# Altium schematic sheet USB PD.SchDoc: USB PD
size 431 x 279 mm; DrawnBy: DD; DocumentNumber: GHL-1-21002; Revision: A; SheetNumber: 5; SheetTotal: 7; ProjectID: 263-03
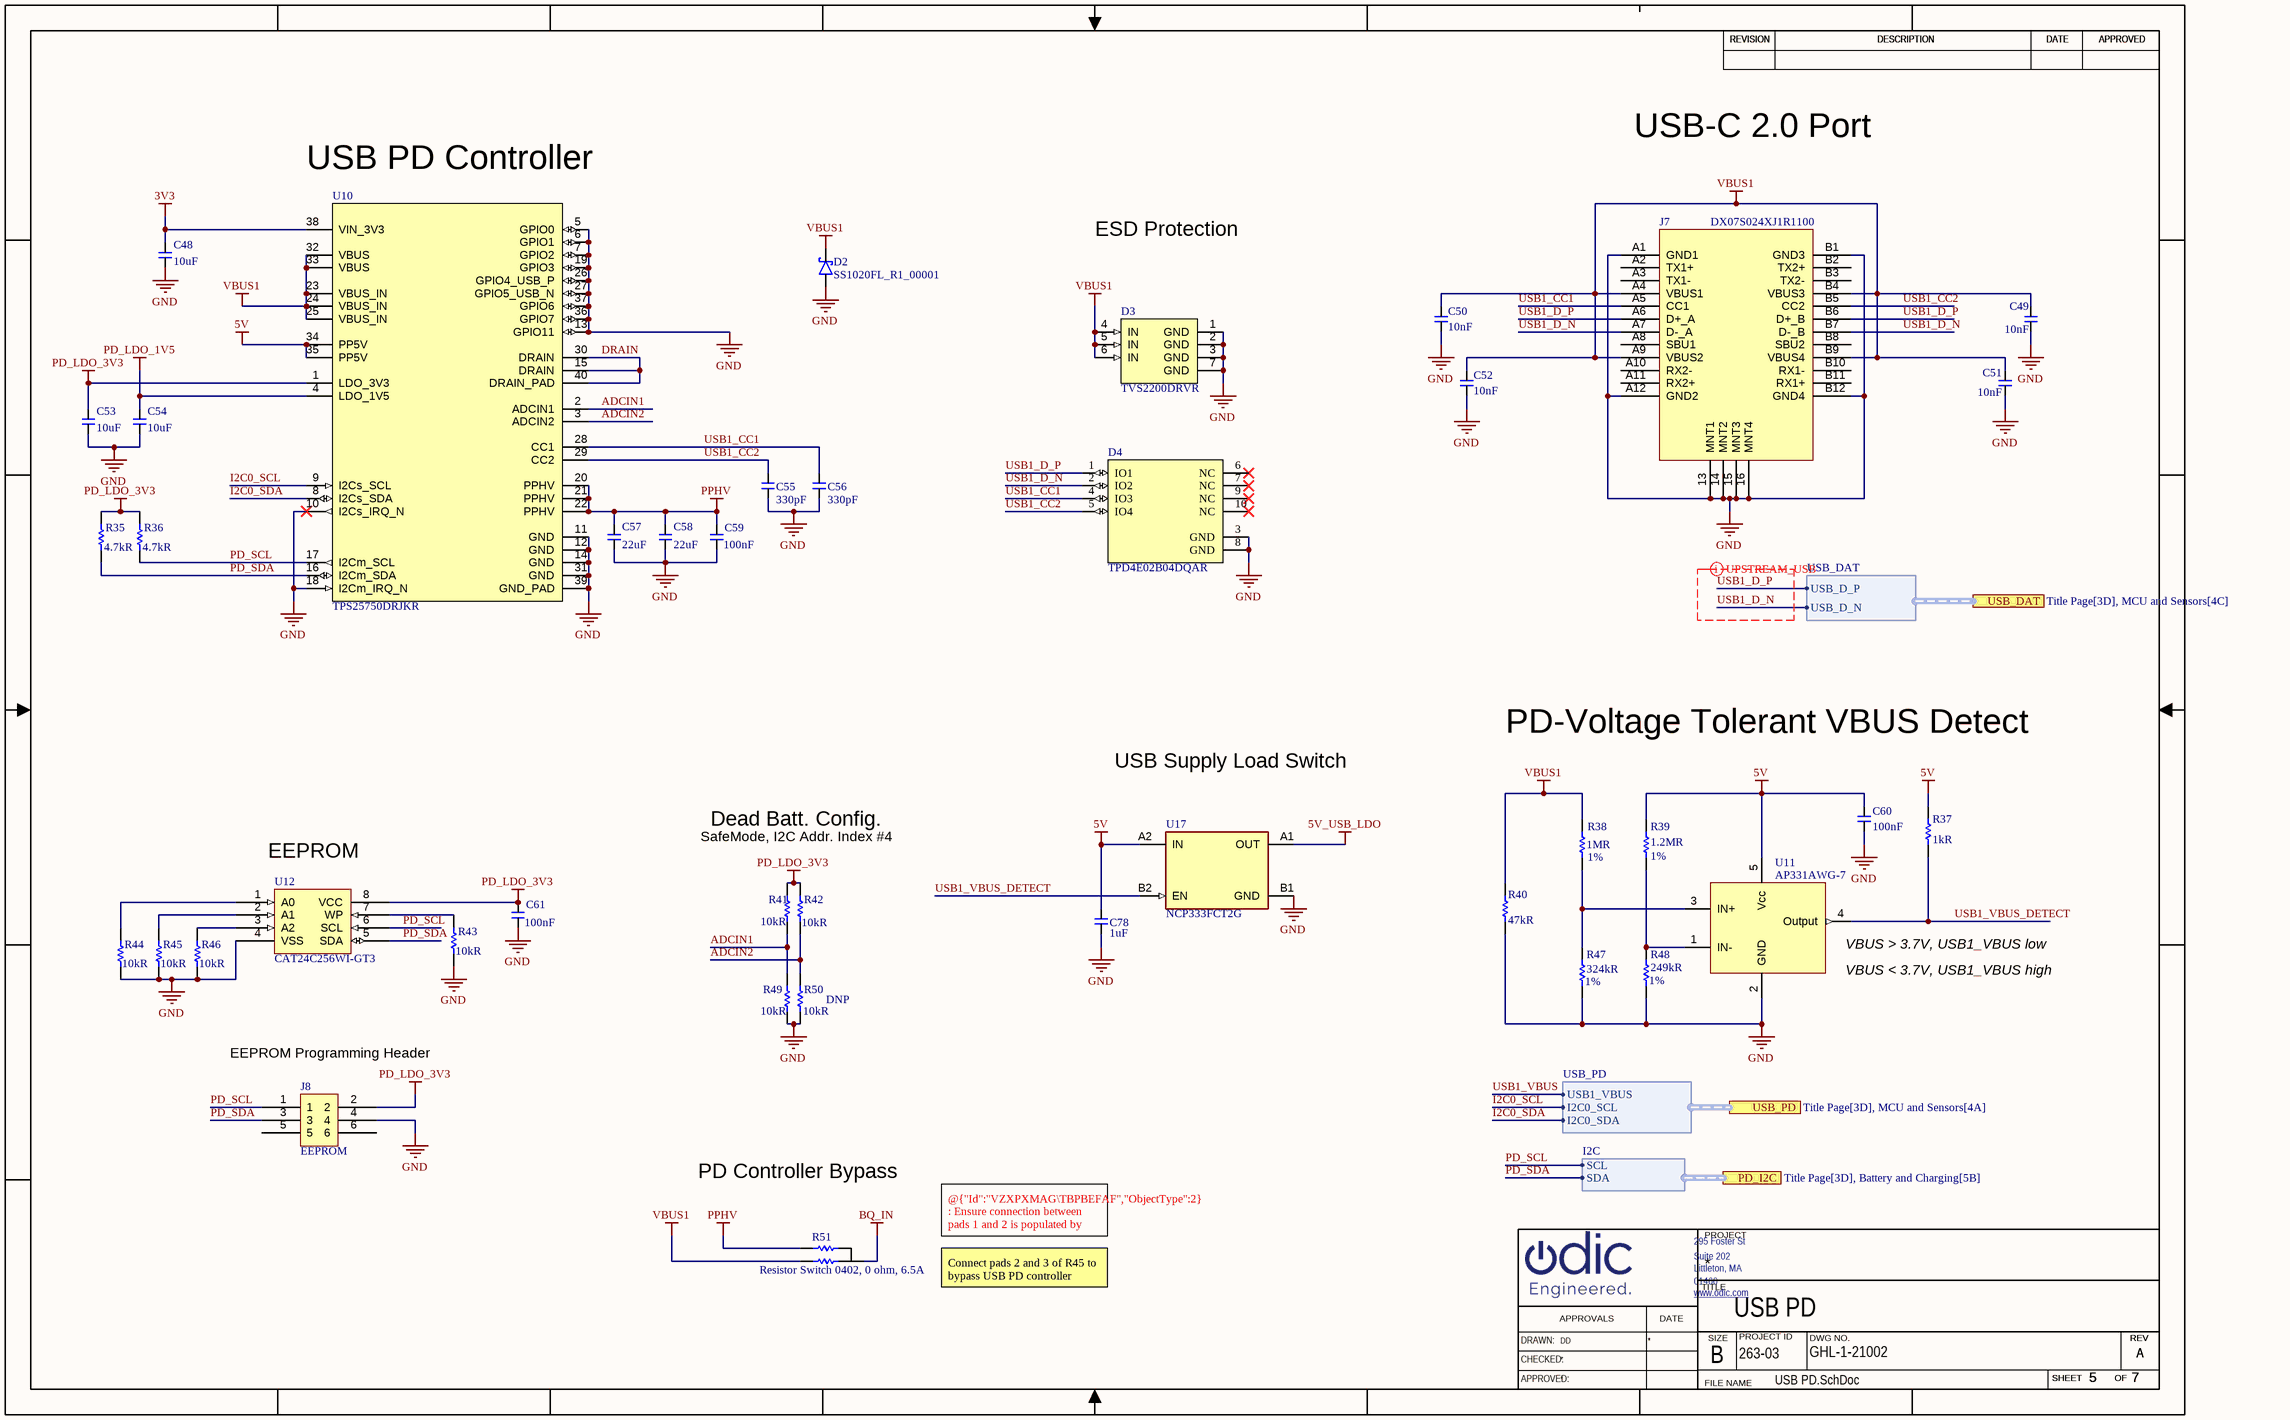
[diagram p0: USB PD.SchDoc]

## Parts
C48  Capacitance: 10uF  [C0402]  (hidden comment: C0402_10u_10V_20pct)
C49  value 10nF  [C0402]  (hidden comment: C0402_10n_35V_10pct)
C50  value 10nF  [C0402]  (hidden comment: C0402_10n_35V_10pct)
C51  value 10nF  [C0402]  (hidden comment: C0402_10n_35V_10pct)
C52  value 10nF  [C0402]  (hidden comment: C0402_10n_35V_10pct)
C53  Capacitance: 10uF  [C0402]  (hidden comment: C0402_10u_10V_20pct)
C54  Capacitance: 10uF  [C0402]  (hidden comment: C0402_10u_10V_20pct)
C55  value 330pF  [C0402]  (hidden comment: C0402_330p_50V_10pct)
C56  value 330pF  [C0402]  (hidden comment: C0402_330p_50V_10pct)
C57  Capacitance: 22uF  [c0805]  (hidden comment: C0805_22u_25V_20pct)
C58  Capacitance: 22uF  [c0805]  (hidden comment: C0805_22u_25V_20pct)
C59  Capacitance: 100nF  [C0402]  (hidden comment: C0402_0u1_25V_10pct)
C60  Capacitance: 100nF  [C0402]  (hidden comment: C0402_100n_16V_10pct)
C61  Capacitance: 100nF  [C0402]  (hidden comment: C0402_0u1_25V_10pct)
C78  Capacitance: 1uF  [C0402]  (hidden comment: C0402_1u_6V3_10pct)
D2  SS1020FL_R1_00001  [sod-123fl_AK]
D3  TVS2200DRVR  [dfn7_2x2_p65mm]
D4  TPD4E02B04DQAR  [dfn10_1p1x2p6_p5mm]
J7  DX07S024XJ1R1100  [USB_JAE_DX07S024XJ1R1100]
J8  EEPROM  [tc2030-mcp-nl]
R35  Resistance: 4.7kR  [R0402]  (hidden comment: R0402_4k7_1pct)
R36  Resistance: 4.7kR  [R0402]  (hidden comment: R0402_4k7_1pct)
R37  Resistance: 1kR  [R0402]  (hidden comment: R0402_1k0_1pct)
R38  value 1MR  Tolerance: 1%  [R0402]  (hidden comment: R0402_1M_1pct)
R39  Resistance: 1.2MR  Tolerance: 1%  [R0402]  (hidden comment: R0402_1M2_1pct)
R40  Resistance: 47kR  [R0402]  (hidden comment: R0402_47k_1pct)
R41  Resistance: 10kR  [R0402]  (hidden comment: R0402_10k_1pct)
R42  Resistance: 10kR  [R0402]  (hidden comment: R0402_10k_1pct)
R43  Resistance: 10kR  [R0402]  (hidden comment: R0402_10k_1pct)
R44  Resistance: 10kR  [R0402]  (hidden comment: R0402_10k_1pct)
R45  Resistance: 10kR  [R0402]  (hidden comment: R0402_10k_1pct)
R46  Resistance: 10kR  [R0402]  (hidden comment: R0402_10k_1pct)
R47  value 324kR  Tolerance: 1%  [R0402]  (hidden comment: R0402_324k_1pct)
R48  Tolerance: 1%  Resistance: 249kR  [R0402]  (hidden comment: R0402_249k_1pct)
R49  Resistance: 10kR  [R0402]  (hidden comment: R0402_10k_1pct)
R50  Resistance: 10kR  Install: DNP  [R0402]  (hidden comment: R0402_10k_1pct)
R51  Resistor Switch 0402, 0 ohm, 6.5A  [r0402x2]
U10  TPS25750DRJKR  [qfn40_6x4_p4mm-RJK0038B]
U11  AP331AWG-7  [SOT25]
U12  CAT24C256WI-GT3  [SO8]
U17  NCP333FCT2G  [bga4_p743xp743_p4mm]

## Ports
PD_I2C (harness I2C, see Title Page[3D], Battery and Charging[5B]), USB_DAT (harness USB_DAT, see Title Page[3D], MCU and Sensors[4C]), USB_PD (harness USB_PD, see Title Page[3D], MCU and Sensors[4A])

## Harnesses
USB_PD: USB1_VBUS, I2C0_SCL, I2C0_SDA
USB_DAT: USB_D_P, USB_D_N
I2C: SCL, SDA

## Nets
3V3: C48.2 U10.38(VIN_3V3)
5V: C60.2 C78.2 R37.2 R39.2 U10.34(PP5V) U10.35(PP5V) U11.5(Vcc) U17.A2(IN)
5V_USB_LDO: U17.A1(OUT)
BQ_IN: R51.2
GND: C48.1 C49.1 C50.1 C51.1 C52.1 C53.1 C54.1 C55.1 C56.1 C57.1 C58.1 C59.1 C60.1 C61.1 C78.1 D2.A D3.1(GND) D3.2(GND) D3.3(GND) D3.7(GND) D4.3(GND) D4.8(GND) J7.13(MNT1) J7.14(MNT2) J7.15(MNT3) J7.16(MNT4) J7.A1(GND1) J7.A12(GND2) J7.B1(GND3) J7.B12(GND4) J8.4 R40.1 R43.1 R44.1 R45.1 R46.1 R47.1 R48.1 R49.1 R50.1 U10.5(GPIO0) U10.6(GPIO1) U10.7(GPIO2) U10.10(I2Cs_IRQ_N) U10.11(GND) U10.12(GND) U10.13(GPIO11) U10.14(GND) U10.18(I2Cm_IRQ_N) U10.19(GPIO3) U10.26(GPIO4_USB_P) U10.27(GPIO5_USB_N) U10.31(GND) U10.36(GPIO7) U10.37(GPIO6) U10.39(GND_PAD) U11.2(GND) U12.4(VSS) U17.B1(GND)
PD_LDO_1V5: C54.2 U10.4(LDO_1V5)
PD_LDO_3V3: C53.2 C61.2 J8.2 R35.2 R36.2 R41.2 R42.2 U10.1(LDO_3V3) U12.8(VCC)
PPHV: C57.2 C58.2 C59.2 R51.1 U10.20(PPHV) U10.21(PPHV) U10.22(PPHV)
VBUS1: C49.2 C50.2 C51.2 C52.2 D2.K D3.4(IN) D3.5(IN) D3.6(IN) J7.A4(VBUS1) J7.A9(VBUS2) J7.B4(VBUS3) J7.B9(VBUS4) R38.2 R40.2 R51.3 U10.23(VBUS_IN) U10.24(VBUS_IN) U10.25(VBUS_IN) U10.32(VBUS) U10.33(VBUS)
ADCIN1: R41.1 R49.2 U10.2(ADCIN1)
ADCIN2: R42.1 R50.2 U10.3(ADCIN2)
DRAIN: U10.15(DRAIN) U10.30(DRAIN) U10.40(DRAIN_PAD)
I2C0_SCL: U10.9(I2Cs_SCL) ; port USB_PD.I2C0_SCL
I2C0_SDA: U10.8(I2Cs_SDA) ; port USB_PD.I2C0_SDA
PD_SCL: J8.1 R36.1 U10.17(I2Cm_SCL) U12.6(SCL) ; port PD_I2C.SCL
PD_SDA: J8.3 R35.1 U10.16(I2Cm_SDA) U12.5(SDA) ; port PD_I2C.SDA
USB1_CC1: C56.2 D4.4(IO3) J7.A5(CC1) U10.28(CC1)
USB1_CC2: C55.2 D4.5(IO4) J7.B5(CC2) U10.29(CC2)
USB1_D_N: D4.2(IO2) J7.A7(D-_A) J7.B7(D-_B) ; port USB_DAT.USB_D_N
USB1_D_P: D4.1(IO1) J7.A6(D+_A) J7.B6(D+_B) ; port USB_DAT.USB_D_P
USB1_VBUS: port USB_PD.USB1_VBUS
USB1_VBUS_DETECT: R37.1 U11.4(Output) U17.B2(EN)
NetR38_1: R38.1 R47.2 U11.3(IN+)
NetR39_1: R39.1 R48.2 U11.1(IN-)
NetR43_2: R43.2 U12.7(WP)
NetR44_2: R44.2 U12.1(A0)
NetR45_2: R45.2 U12.2(A1)
NetR46_2: R46.2 U12.3(A2)

Not connected (* = marked no-connect by the designer): D4 6(NC)* 7(NC)* 9(NC)* 10(NC)*; J7 A2(TX1+) A3(TX1-) A8(SBU1) A10(RX2-) A11(RX2+) B2(TX2+) B3(TX2-) B8(SBU2) B10(RX1-) B11(RX1+); J8 5 6

## Layout directives
differential pair: USB1_D_N, USB1_D_P

## Notes on the sheet
- USB-C 2.0 Port
- USB PD Controller
- ESD Protection
- USB Supply Load Switch
- PD-Voltage Tolerant VBUS Detect
- (near U12) EEPROM
- SafeMode, I2C Addr. Index #4
- Dead Batt. Config.
- (near U11) VBUS > 3.7V, USB1_VBUS low
- (near U11) VBUS < 3.7V, USB1_VBUS high
- (near J8) EEPROM Programming Header
- PD Controller Bypass
- @{"Id":"VZXPXMAG\TBPBEFAF","ObjectType":2} : Ensure connection between pads 1 and 2 is populated by default
- Connect pads 2 and 3 of R45 to bypass USB PD controller
- REVISION
- DESCRIPTION
- DATE
- APPROVED
- 295 Foster St
- PROJECT
- www.odic.com <http://www.odic.com>
- Littleton, MA
- 01460
- Suite 202
- TITLE
- DRAWN:
- CHECKED:
- APPROVALS
- SIZE
- B
- PROJECT ID
- DWG NO.
- SHEET
- OF
- REV
- APPROVED:
- FILE NAME

## Library data of the parts
C48 C53 C54 = CMP-00507-2: Ceramic capacitor SMD; 0402; 10uF; 10V; X5R; 20%; Install: POP; Dielectric: X5R; Tolerance: 20%; Voltage Rating: 10V; Case Code (Imperial): 0402
C49-C52 = CMP-00724-2: Multilayer Ceramic Capacitor, 0.01 uF, 35 V, ± 10%, X7R, 0402 [1005 Metric]; Voltage Rating (DC): 35V; Install: POP; Packaging: Tape and Reel; Voltage Rating: 35V; Height: 0.5mm; Package Quantity: 1; Max Operating Temperature: 125°C; Length: 1mm; Width: 0.02inch; RoHS Compliant: Yes; Case/Package: 0402; Weight: 2.3E-05oz; Thickness: 0.022inch; Reach SVHC Compliant: No; Tolerance: 10%; Min Operating Temperature: -55°C; Mounting Technology: Surface Mount; Termination: SMD/SMT; Case Code (Metric): 1005; Dielectric: X7R; Series: CGA; Case Code (Imperial): 0402; Depth: 0.5mm; Ratings: AEC-Q200
C55 C56 = CMP-00652-2: 0402 330 pF 50 V ±5% Tolerance C0G SMT Multilayer Ceramic Capacitor; Insulation Resistance: 10GR; Voltage: 50V; Temperature Coefficient: 30ppm/°C; Install: POP; Material: Ceramic; Depth: 0.5mm; Termination: SMD/SMT; Dielectric: C0G; Packaging: Tape and Reel; Case/Package: 0402; Height: 0.5mm; Length: 1mm; Lead Free: Lead Free; RoHS Compliant: Yes; Thickness: 0.022inch; Case Code (Metric): 1005; Case Code (Imperial): 0402; Width: 0.5mm; Size: 0.5mm; Radiation Hardening: No; Pins: 2; Voltage Rating: 50V; Reach SVHC Compliant: No; Mounting Technology: Surface Mount; Tolerance: 5%; Min Operating Temperature: -55°C; Voltage Rating (DC): 50V; Construction: Flat; Package Quantity: 1; Max Operating Temperature: 125°C; Series: GRM
C57 C58 = CMP-00654-4: Multilayer Ceramic Capacitor, 22 uF, 25 V, ± 20%, X5R, 0805 [2012 Metric]; Install: POP; RoHS Compliant: Yes
C59 C61 = CMP-00369-1: Cap Ceramic 0.1uF 25V X5R 10% Pad SMD 0402 Multi Layer Ceramic Capacitor (MLCC); Install: POP; Packaging: Tape and Reel; Construction: Flat; Max Operating Temperature: 85°C; Case Code (Metric): 1005; Voltage Rating (DC): 25V; Min Operating Temperature: -55°C; Height: 0.5mm; Series: CL; Case/Package: 0402; Voltage: 25V; Package Quantity: 1; Radiation Hardening: No; Depth: 0.5mm; Thickness: 0.022inch; Lead Free: Lead Free; Tolerance: 10%; Length: 1mm; Mount: Surface Mount; Width: 0.02inch; Dielectric: X5R; RoHS Compliant: Yes; Voltage Rating: 25V; Case Code (Imperial): 0402
C60 = CMP-00301-3: 0.1 µF ±10% 16V Ceramic Capacitor X7R 0402 (1005 Metric); Install: POP; Voltage: 16V; Voltage Rating (DC): 16V; Case/Package: 0402; RoHS Compliant: Yes; Dielectric Material: Ceramic; Package Quantity: 1; Dielectric: X7R; Termination: SMD/SMT; Depth: 0.5mm; Radiation Hardening: No; Construction: Flat; Tolerance: 10%; Case Code (Imperial): 0402; Voltage Rating: 16V; Max Operating Temperature: 125°C; Length: 1mm; Lead Free: Lead Free; REACH SVHC: No SVHC; Packaging: Tape and Reel; Mount: Surface Mount,PCB; Series: -; Case Code (Metric): 1005; Min Operating Temperature: -55°C; Width: 0.02inch; Thickness: 0.022inch; Height: 0.56mm; Contact Plating: Tin,Matte
C78 = CMP-00342-1: Cap Ceramic 1uF 6.3V X5R 10% SMD 0402 85C Paper T/R; Install: POP; Max Operating Temperature: 85°C; RoHS Compliant: Yes; Number of Pins: 2; Packaging: Tape and Reel; Thickness: 0.022inch; Lead Free: Lead Free; Package Quantity: 10000; Tolerance: 10%; Height: 0.5mm; Depth: 0.5mm; Construction: Flat; Radiation Hardening: No; REACH SVHC: No SVHC; Dielectric: X5R; Resistor Type: Ceramic; Min Operating Temperature: -55°C; Series: M; Width: 0.5mm; Case/Package: 0402; Voltage Rating: 6.3V; Case Code (Imperial): 0402; Length: 1mm; Voltage Rating (DC): 6.3V; Halogen Free: Halogen Free; Termination: SMD/SMT; Mount: Surface Mount; Case Code (Metric): 1005
D2 = CMP-00259-3: Diode Schottky 20V 1A 2-Pin SOD-123FL T/R; Peak Non-Repetitive Surge Current: 40A; Element Configuration: Single; Max Reverse Current: 500uA; Install: POP; Radiation Hardening: No; Max Repetitive Reverse Voltage (Vrrm): 20V; Mount: Surface Mount; RoHS Compliant: Yes; Min Operating Temperature: -55°C; Max Operating Temperature: 125°C; Number of Pins: 2
D3 = CMP-00678-2: 22-V flat-clamp surge protection device 6-WSON -40 to 125; Clamping Voltage: 28V; Install: POP; Number of Channels: 1; RoHS Compliant: Yes; Series: -; Number of Circuits: 1; Max Operating Temperature: 125°C; Mounting Technology: Surface Mount; Min Operating Temperature: -40°C; Packaging: Cut Tape
D4 = CMP-00677-2: Quad 0.25-pF, ±3.6-V, ±12-kV ESD protection diode for USB 3.0, HDMI 2.0 & High Speed Signals; Power Line Protection: No; Number of Channels: 4; Diode Type: ZENER; Install: POP; Peak Pulse Power: 17W; Reverse Standoff Voltage: 3.6V; Interface: USB,HDMI; Peak Pulse Current: 5A; Min Breakdown Voltage: 5.5V; Pins: 10; Min Operating Temperature: -40°C; Max Operating Temperature: 125°C; Series: -; Packaging: Cut Tape; RoHS Compliant: Yes; Mounting Technology: Surface Mount; Reach SVHC Compliant: No; Number of Bidirectional Channels: 4; Operating Supply Voltage: 3.6V; Lead Free: Lead Free
J7 = CMP-00680-3: USB C Connector, 24 Contact(s), Female, Right Angle, Solder and Surface Mount Terminal, Locking, Receptacle; Mating Cycles: 10000; Number of Ports: 1; Voltage Rating: 20V; Number of Contacts: 24; Shielding: Shielded; Install: POP; Max Operating Temperature: 80°C; Min Operating Temperature: -30°C; Insulation Color: Black; Contact Plating: Gold; Termination: Solder; Connector Type: USB; RoHS Compliant: Yes; Series: DX07; Gender: Receptacle; Mounting Technology: Surface Mount,Through Hole,Horizontal; Packaging: Cut Tape
J8 = CMP-00144-9: 6 Pin Tag-Connect Header Footprint. Pads.; Install: DNP
R35 R36 = CMP-00336-2: RES 4.7K OHM 1% 1/16W 0402; Install: POP; Temperature Coefficient: 100ppm/°C; Voltage Rating: 50V; Max Power Dissipation: 63mW; Power Rating: 62.5mW; Features: Moisture Resistant; Length: 1mm; REACH SVHC: No SVHC; RoHS Compliant: Yes; Military Standard: Not; Size Code: 0402; Series: RC; Width: 0.5mm; Lead Free: Lead Free; Max Operating Temperature: 155°C; Height: 0.32mm; Voltage Rating (DC): 50V; Construction: Rectangular; Packaging: Tape and Reel; Tolerance: 1%; Case Code (Metric): 1005; Case Code (Imperial): 0402; Number of Pins: 2; Resistor Type: Thick Film; Number of Terminations: 2; Termination: SMD/SMT; Min Operating Temperature: -55°C; Case/Package: 0402; Height - Seated (Max): 0.016inch; Resistance Tolerance: 1%; Depth: 0.5mm
R37 = CMP-00307-2: Surface Mount Chip Resistor, Thick Film, RC Series, 1 kohm, 62.5 mW, 1%, 50 V, 0402 [1005 Metric]; Voltage Rating (DC): 50V; Install: POP; Temperature Coefficient: 100ppm/°C; Power Rating: 62.5mW; Max Power Dissipation: 63mW; Length: 1mm; Resistance Tolerance: 1%; Lead Free: Lead Free; Size Code: 0402; Technology: THICK FILM; Case/Package: 0402; RoHS Compliant: Yes; Series: RC; Number of Pins: 2; Height: 0.32mm; Tolerance: 1%; Resistor Type: Thick Film; Military Standard: Not; Termination: SMD/SMT; Voltage Rating: 50V; Construction: Rectangular; Packaging: Tape and Reel; Depth: 0.5mm; Features: Moisture Resistant; REACH SVHC: No SVHC; Width: 0.5mm; Min Operating Temperature: -55°C; Max Operating Temperature: 155°C; Number of Terminations: 2; Case Code (Metric): 1005; Case Code (Imperial): 0402
R38 = CMP-00671-3: Res Thick Film 0402 1M Ohm 1% 0.063W(1/16W) ±100ppm/C Pad SMD T/R; Install: POP; Temperature Coefficient: 100ppm/°C; Voltage Rating (DC): 50V; Power Rating: 62.5mW; Case Code (Metric): 1005; Reach SVHC Compliant: Unknown; Resistor Type: Thick Film; Series: WR04X; Depth: 0.5mm; Contact Material: Tin; Packaging: Tape and Reel; RoHS Compliant: Yes; Min Operating Temperature: -55°C; Package Quantity: 10000; Case Code (Imperial): 0402; Resistance Tolerance: 1%; Construction: Rectangular; Width: 0.5mm; Max Operating Temperature: 155°C; Lead Free: Lead Free; Case/Package: 0402; Height: 0.35mm; Termination: SMD/SMT; Voltage Rating: 50V; Mounting Technology: Surface Mount; Length: 1mm; Military Standard: Not
R39 = CMP-00360-2: Res Thick Film 0402 1.2M Ohm 1% 0.063W(1/16W) ±100ppm/C Pad SMD Automotive T/R; Power Rating: 62.5mW; Temperature Coefficient: 100ppm/°C; Max Power Dissipation: 63mW; Install: POP; Voltage Rating: 50V; Max Operating Temperature: 155°C; Series: AC; Case Code (Imperial): 0402; Packaging: Tape and Reel; Case Code (Metric): 1005; Number of Terminations: 2; Termination: SMD/SMT; Min Operating Temperature: -55°C; Case/Package: 0402; Features: Moisture Resistant,Automotive AEC-Q200; Resistor Type: Thick Film; RoHS Compliant: Yes; Length: 0.039inch; Height: 0.015inch; Width: 0.5mm
R40 = CMP-00310-2: Res General Purpose Thick Film 0402 47K Ohm 1% 1/16W ±100ppm/°C Molded SMD Paper T/R; Power Rating: 62.5mW; Voltage Rating: 50V; Max Power Dissipation: 63mW; Install: POP; Tolerance: 1%; Max Operating Temperature: 155°C; Depth: 0.5mm; Height: 0.016inch; Case Code (Metric): 1005; Min Operating Temperature: -55°C; REACH SVHC: Unknown; Package Quantity: 1; Case/Package: 0402; Features: Moisture Resistant; Number of Terminations: 2; RoHS Compliant: Yes; Construction: Rectangular; Resistance Tolerance: 1%; Size Code: 0402; Length: 1mm; Lead Free: Lead Free; Case Code (Imperial): 0402; Military Standard: Not; Resistor Type: Thick Film; Termination: SMD/SMT; Packaging: Tape and Reel; Temperature Coefficient: 100ppm/°C; Width: 0.02inch; Series: RC
R41-R46 R49 = CMP-00352-1: Res Thick Film 0402 10K Ohm 1% 1/16W ±100ppm/°C Molded SMD SMD T/R; Max Power Dissipation: 63mW; Install: POP; RoHS Compliant: Yes; Number of Terminations: 2; Case/Package: 0402; Case Code (Metric): 1005; Length: 0.039inch; Military Standard: Not; Size Code: 0402; Series: RC; Height: 0.016inch; Contact Plating: Tin; Features: Moisture Resistant; Width: 0.02inch; Mount: Surface Mount; Temperature Coefficient: 100ppm/°C; Package Quantity: 1; Resistor Type: Thick Film; Min Operating Temperature: -55°C; Max Operating Temperature: 155°C; Power Rating: 63mW; Tolerance: 1%; Depth: 0.5mm; Case Code (Imperial): 0402; Construction: Rectangular; Packaging: Tape and Reel; Radiation Hardening: No
R47 = CMP-00725-1: SMD Chip Resistor, 324 kOhm, ± 1%, 63 mW, 0402 [1005 Metric], Thick Film, General Purpose; Voltage Rating (DC): 50V; Temperature Coefficient: 100ppm/°C; Max Power Dissipation: 63mW; Power Rating: 62.5mW; Install: POP; Voltage Rating: 50V; Case/Package: 0402; Number of Terminations: 2; Military Standard: Not; Packaging: Tape and Reel; Construction: Rectangular; Contact Plating: Tin,Matte; Max Operating Temperature: 155°C; Height: 0.016inch; Lead Free: Lead Free; Series: RC; Termination: SMD/SMT; Length: 1mm; Case Code (Imperial): 0402; Case Code (Metric): 1005; RoHS Compliant: Yes; Features: Moisture Resistant; Depth: 0.5mm; Width: 0.5mm; Min Operating Temperature: -55°C
R48 = CMP-00382-1: Res Thick Film 0402 249K Ohm 1% 0.063W ±100ppm/°C Molded SMD Paper T/R; Max Power Dissipation: 63mW; Install: POP; Series: RMCF; Max Operating Temperature: 155°C; Temperature Coefficient: 100ppm/°C; Height: 0.016inch; Mount: Surface Mount; Case Code (Metric): 1005; Packaging: Tape and Reel; Case Code (Imperial): 0402; Min Operating Temperature: -55°C; Length: 0.039inch; Ratings: AEC-Q200; Features: Automotive AEC-Q200; Radiation Hardening: No; Depth: 0.5mm; Military Standard: Not; Number of Terminations: 2; RoHS Compliant: Yes; Width: 0.02inch; Case/Package: 0402; Resistor Type: Thick Film; Construction: Rectangular; Contact Plating: Tin,Matte
R50 = CMP-00352-1: Res Thick Film 0402 10K Ohm 1% 1/16W ±100ppm/°C Molded SMD SMD T/R; Max Power Dissipation: 63mW; RoHS Compliant: Yes; Number of Terminations: 2; Case/Package: 0402; Case Code (Metric): 1005; Length: 0.039inch; Military Standard: Not; Size Code: 0402; Series: RC; Height: 0.016inch; Contact Plating: Tin; Features: Moisture Resistant; Width: 0.02inch; Mount: Surface Mount; Temperature Coefficient: 100ppm/°C; Package Quantity: 1; Resistor Type: Thick Film; Min Operating Temperature: -55°C; Max Operating Temperature: 155°C; Power Rating: 63mW; Tolerance: 1%; Depth: 0.5mm; Case Code (Imperial): 0402; Construction: Rectangular; Packaging: Tape and Reel; Radiation Hardening: No
R51 = CMP-009-00020-2: Symbol and footprint for Resistor Switch. Part selection for 0402 0 ohm jumper rated for 6.5A. Pads 1 and 2 populated by default.; Temperature Coefficient: 200ppm/°C; Max Power Dissipation: 63mW; Resistance: 0R; Power Rating: 3W; Voltage Rating (DC): 50V; Tolerance: 5%; Install: POP; Mount: Surface Mount; Package Quantity: 10000; Max Operating Temperature: 155°C; Contact Plating: Tin; Military Standard: Not; Height: 0.016inch; Resistor Type: Thick Film; Height - Seated (Max): 0.016inch; Case/Package: 0402; Length: 0.039inch; Depth: 0.5mm; Number of Terminations: 2; Packaging: Tape and Reel; Features: Automotive AEC-Q200; Lead Free: Lead Free; Min Operating Temperature: -55°C; Width: 0.02inch
U10 = CMP-00653-4: Highly integrated USB Type-C® and USB PD controller with pre-configured GUI 38-WQFN -40 to 125; Install: POP
U11 = CMP-00170-5: IC COMPARATOR SGL DIFF SOT-25; Natural Thermal Resistance: 173°C/W; Voltage Gain: 106.02dB; Power Dissipation: 740mW; Supply Current: 1mA; Min Dual Supply Voltage: 1V; Max Supply Voltage: 36V; Number of Elements: 1; Quiescent Current: 2.5mA; Input Bias Current: 400nA; Response Time: 1.3us; Input Offset Voltage (Vos): 8mV; Output Type: TTL; Output Compatibility: CMOS; Min Supply Voltage: 2V; Output Current: 16mA; Max Dual Supply Voltage: 18V; Install: POP; Length: 3.1mm; Lead Free: Lead Free; Series: -; Type: General Purpose; Technology: BIPOLAR; Width: 1.7mm; Max Operating Temperature: 70°C; Mount: Surface Mount; Nominal Supply Current: 1mA; Package Quantity: 3000; Radiation Hardening: No; Max Supply Current: 1mA; Min Operating Temperature: 0°C; Packaging: Tape and Reel; Max Input Current: 400nA; REACH SVHC: No SVHC; Max Power Dissipation: 740mW; Height: 1.3mm; Number of Channels: 1; Number of Pins: 5; Case/Package: SOT-25; RoHS Compliant: Yes
U12 = CMP-00660-3: IC EEPROM 256KBIT 400KHZ 8SOIC; Supply Current: 3mA; Operating Supply Voltage: 5V; Density: 256Kb; Write Protection: YES; Access Time: 500ns; Nominal Supply Voltage: 5.5V; Organization: 32KX8; Memory Format: Non-Volatile,EEPROM; Interface: I2C,Serial; Memory Size: 32000; Min Supply Voltage: 1.8V; Write Cycle Time-Max (tWC): 5ms; Access Time-Max: 900ns; Frequency: 1MHz; Install: POP; Lead Free: Lead Free; Reach SVHC Compliant: No; Packaging: Tape and Reel; Mounting Technology: Surface Mount; Case/Package: SOIC; Max Operating Temperature: 85°C; Height: 1.5mm; Pins: 8; Length: 5mm; Max Supply Voltage: 5.5V; Halogen Free: Halogen Free; RoHS Compliant: Yes; Series: -; Radiation Hardening: No; Width: 4mm; Clock Frequency: 400kHz; Min Operating Temperature: -40°C
U17 = CMP-00215-5: IC LOAD SWITCH W/DIS 1.5A 4WLCSP; On-State Resistance: 400mR; Turn-On Delay Time: 195us; Install: POP; Power Dissipation: 400mW; Number of Outputs: 1; Output Configuration: High Side; Operating Supply Voltage: 5.5V; Interface: On/Off; Packaging: Tape and Reel; Max Supply Current: 1.5A; Number of Pins: 4; Package Quantity: 3000; Max Operating Temperature: 85°C; RoHS Compliant: Yes; Min Operating Temperature: -40°C; Lead Free: Lead Free; Output Current: 1.5A; Max Power Dissipation: 400mW; Mount: Surface Mount; Series: -; Max Output Current: 1.5A; Halogen Free: Halogen Free